# EasyEDA schematic schematic.easyeda.json
TITLE: Lunatic MIDI organ pedalboard interface; REV: 1.0; Date: 2019-04-25; Sheet: 1/1; Drawn By: Marco Sacchi
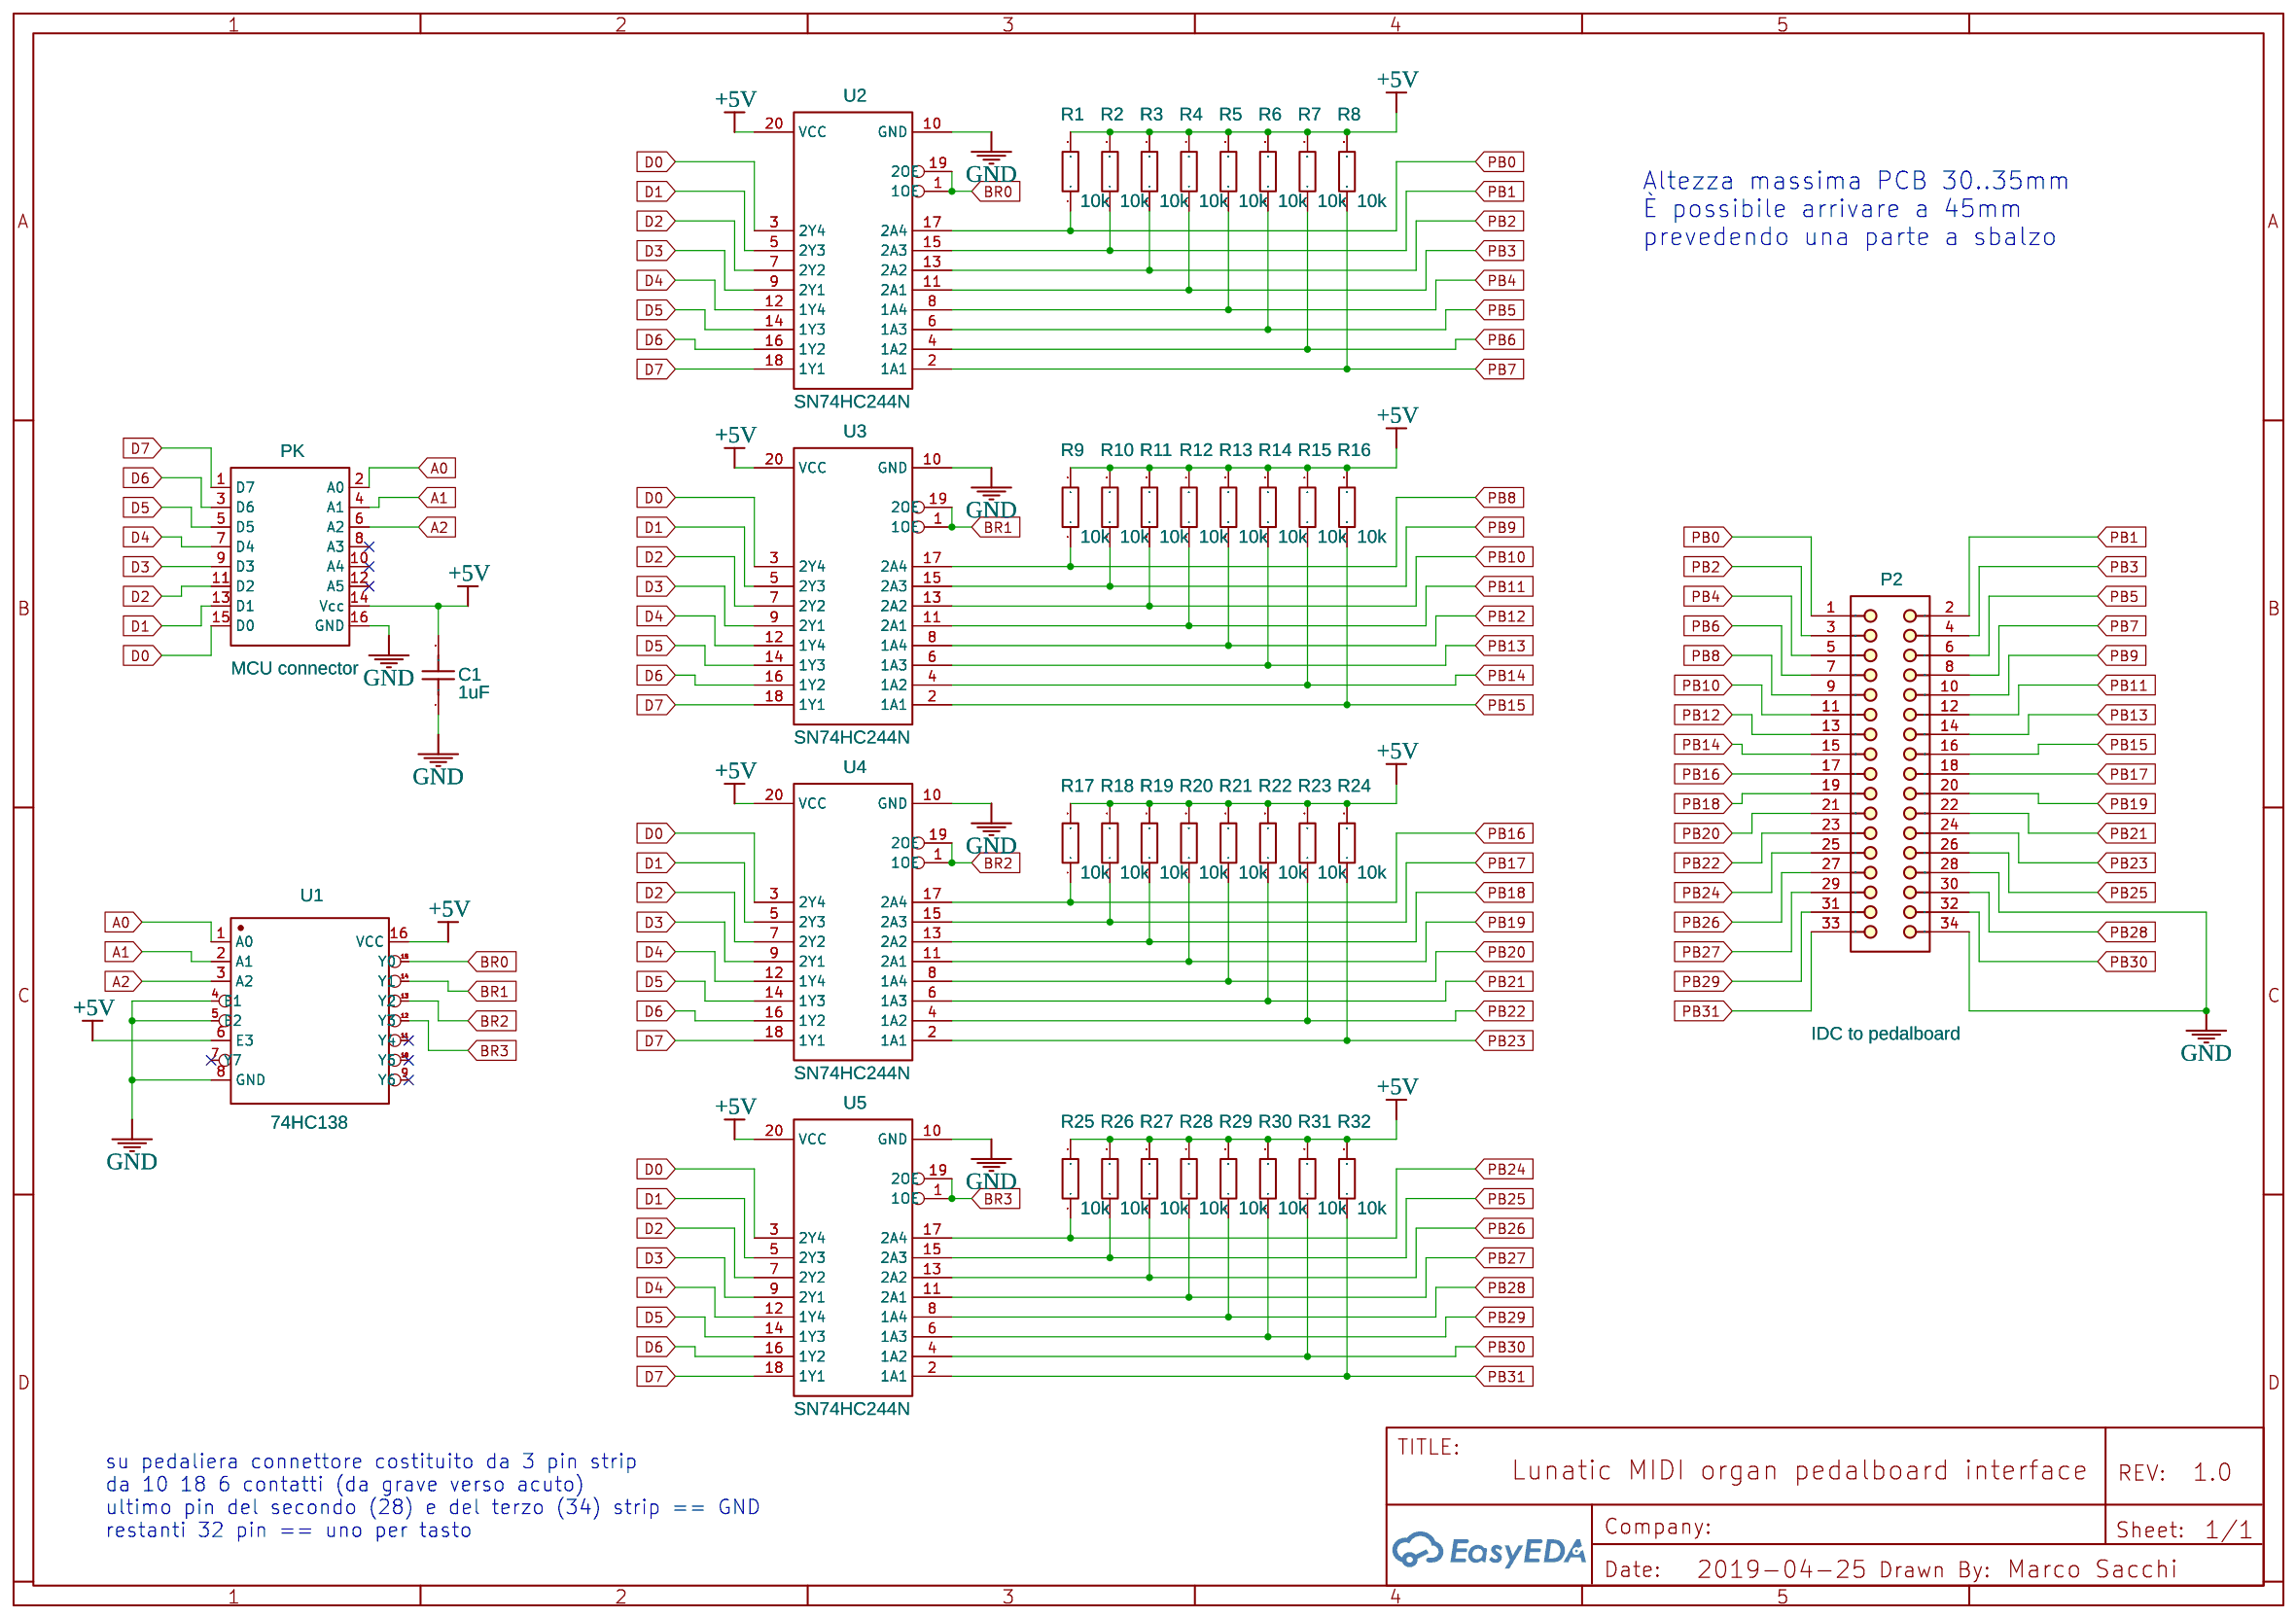
[diagram p0: schematic sheet]

## Parts
C1  1uF  [RAD-0.1]
P2  IDC to pedalboard  [918534X324]
PK  MCU connector  [HDR-8X2/2.54]
R1  10k  [AXIAL-0.3]
R2  10k  [AXIAL-0.3]
R3  10k  [AXIAL-0.3]
R4  10k  [AXIAL-0.3]
R5  10k  [AXIAL-0.3]
R6  10k  [AXIAL-0.3]
R7  10k  [AXIAL-0.3]
R8  10k  [AXIAL-0.3]
R9  10k  [AXIAL-0.3]
R10  10k  [AXIAL-0.3]
R11  10k  [AXIAL-0.3]
R12  10k  [AXIAL-0.3]
R13  10k  [AXIAL-0.3]
R14  10k  [AXIAL-0.3]
R15  10k  [AXIAL-0.3]
R16  10k  [AXIAL-0.3]
R17  10k  [AXIAL-0.3]
R18  10k  [AXIAL-0.3]
R19  10k  [AXIAL-0.3]
R20  10k  [AXIAL-0.3]
R21  10k  [AXIAL-0.3]
R22  10k  [AXIAL-0.3]
R23  10k  [AXIAL-0.3]
R24  10k  [AXIAL-0.3]
R25  10k  [AXIAL-0.3]
R26  10k  [AXIAL-0.3]
R27  10k  [AXIAL-0.3]
R28  10k  [AXIAL-0.3]
R29  10k  [AXIAL-0.3]
R30  10k  [AXIAL-0.3]
R31  10k  [AXIAL-0.3]
R32  10k  [AXIAL-0.3]
U1  74HC138  [DIP-16]
U2  SN74HC244N  [DIP-20]
U3  SN74HC244N  [DIP-20]
U4  SN74HC244N  [DIP-20]
U5  SN74HC244N  [DIP-20]

## Library data of the parts
C1 = Cap_RAD-0.1_US: Manufacturer Part: ?
P2 = -: Flat Cable Connector (IDC), Low-Profile Male Header, Straight Solder Pin, 34 Contacts, Performance Level 3; Manufacturer Part: AWHW 34G-0202-T; Supplier: RS-Online; Supplier Part: 674-1243; Manufacturer: ASSMANN WSW
PK = -: Manufacturer Part: GEM; image: //image.lceda.cn/szlcsc/C30734.jpg
R1-R32 = Res_AXIAL-0.3(1/8W)_EU: Manufacturer Part: ?
U1 = -: Manufacturer: STMicroelectronics; Supplier Part: C5194; Contributor: Lunatic electronics; Package Display: No
U2-U5 = -: Octal 3-State D-Type Edge-Triggered Flip-Flop; Contributor: Lunatic electronics; Supplier: RS-Online; Supplier Part: 333-3072; link: http://www.ti.com/lit/ds/symlink/sn74hc244.pdf; Manufacturer: Texas Instruments

## Nets
+5V: C1.2 PK.14(Vcc) R1.2 R2.2 R3.2 R4.2 R5.2 R6.2 R7.2 R8.2 R9.2 R10.2 R11.2 R12.2 R13.2 R14.2 R15.2 R16.2 R17.2 R18.2 R19.2 R20.2 R21.2 R22.2 R23.2 R24.2 R25.2 R26.2 R27.2 R28.2 R29.2 R30.2 R31.2 R32.2 U1.6(E3) U1.16(VCC) U2.20(VCC) U3.20(VCC) U4.20(VCC) U5.20(VCC)
GND: C1.1 P2.28 P2.34 PK.16(GND) U1.4(E1) U1.5(E2) U1.8(GND) U2.10(GND) U3.10(GND) U4.10(GND) U5.10(GND)
A0: PK.2(A0) U1.1(A0)
A1: PK.4(A1) U1.2(A1)
A2: PK.6(A2) U1.3(A2)
BR0: U1.15(Y0) U2.1(1OE) U2.19(2OE)
BR1: U1.14(Y1) U3.1(1OE) U3.19(2OE)
BR2: U1.13(Y2) U4.1(1OE) U4.19(2OE)
BR3: U1.12(Y3) U5.1(1OE) U5.19(2OE)
D0: PK.15(D0) U2.3(2Y4) U3.3(2Y4) U4.3(2Y4) U5.3(2Y4)
D1: PK.13(D1) U2.5(2Y3) U3.5(2Y3) U4.5(2Y3) U5.5(2Y3)
D2: PK.11(D2) U2.7(2Y2) U3.7(2Y2) U4.7(2Y2) U5.7(2Y2)
D3: PK.9(D3) U2.9(2Y1) U3.9(2Y1) U4.9(2Y1) U5.9(2Y1)
D4: PK.7(D4) U2.12(1Y4) U3.12(1Y4) U4.12(1Y4) U5.12(1Y4)
D5: PK.5(D5) U2.14(1Y3) U3.14(1Y3) U4.14(1Y3) U5.14(1Y3)
D6: PK.3(D6) U2.16(1Y2) U3.16(1Y2) U4.16(1Y2) U5.16(1Y2)
D7: PK.1(D7) U2.18(1Y1) U3.18(1Y1) U4.18(1Y1) U5.18(1Y1)
PB0: P2.1 R1.1 U2.17(2A4)
PB1: P2.2 R2.1 U2.15(2A3)
PB2: P2.3 R3.1 U2.13(2A2)
PB3: P2.4 R4.1 U2.11(2A1)
PB4: P2.5 R5.1 U2.8(1A4)
PB5: P2.6 R6.1 U2.6(1A3)
PB6: P2.7 R7.1 U2.4(1A2)
PB7: P2.8 R8.1 U2.2(1A1)
PB8: P2.9 R9.1 U3.17(2A4)
PB9: P2.10 R10.1 U3.15(2A3)
PB10: P2.11 R11.1 U3.13(2A2)
PB11: P2.12 R12.1 U3.11(2A1)
PB12: P2.13 R13.1 U3.8(1A4)
PB13: P2.14 R14.1 U3.6(1A3)
PB14: P2.15 R15.1 U3.4(1A2)
PB15: P2.16 R16.1 U3.2(1A1)
PB16: P2.17 R17.1 U4.17(2A4)
PB17: P2.18 R18.1 U4.15(2A3)
PB18: P2.19 R19.1 U4.13(2A2)
PB19: P2.20 R20.1 U4.11(2A1)
PB20: P2.21 R21.1 U4.8(1A4)
PB21: P2.22 R22.1 U4.6(1A3)
PB22: P2.23 R23.1 U4.4(1A2)
PB23: P2.24 R24.1 U4.2(1A1)
PB24: P2.25 R25.1 U5.17(2A4)
PB25: P2.26 R26.1 U5.15(2A3)
PB26: P2.27 R27.1 U5.13(2A2)
PB27: P2.29 R28.1 U5.11(2A1)
PB28: P2.30 R29.1 U5.8(1A4)
PB29: P2.31 R30.1 U5.6(1A3)
PB30: P2.32 R31.1 U5.4(1A2)
PB31: P2.33 R32.1 U5.2(1A1)

Not connected (* = marked no-connect by the designer): PK 8(A3)* 10(A4)* 12(A5)*; U1 7(Y7)* 9(Y6)* 10(Y5)* 11(Y4)*

## Notes on the sheet
- Altezza massima PCB 30..35mm
  È possibile arrivare a 45mm
  prevedendo una parte a sbalzo
- su pedaliera connettore costituito da 3 pin strip
  da 10 18 6 contatti (da grave verso acuto)
  ultimo pin del secondo (28) e del terzo (34) strip == GND
  restanti 32 pin == uno per tasto
